# Altium schematic sheet Wifi.SchDoc
size A; DrawnBy: TIMKEN; SheetNumber: 7; SheetTotal: 7
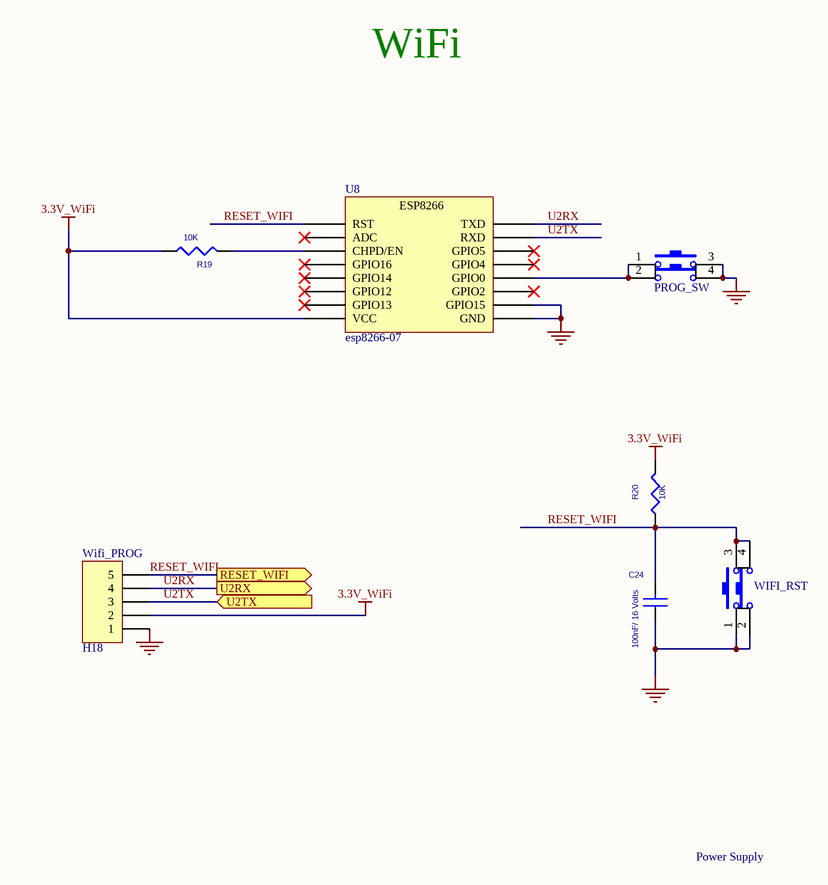
[diagram p0: Wifi.SchDoc]

## Parts
C24  100nF/ 16 Volts  [CAP_CERAMIC]
PROG_SW  SW-SMD  [SWITCH_SMD]  (value not drawn)
R19  10K  [RES_SMD]
R20  10K  [RES_SMD]
U8  esp8266-07  [esp8266-07]
Wifi_PROG  H18  [1x5_single]
WIFI_RST  SW-SMD  [SWITCH_SMD]  (value not drawn)

## Ports
RESET_WIFI (out), U2RX (out), U2TX (in)

## Nets
3.3V_WiFi: R19.1 R20.2 U8.7(VCC) Wifi_PROG.2
GND_POWER: C24.1 PROG_SW.3 PROG_SW.4 U8.8(GND) U8.9(GPIO15) Wifi_PROG.1 WIFI_RST.1 WIFI_RST.2
RESET_WIFI: C24.2 R20.1 U8.0(RST) Wifi_PROG.5 WIFI_RST.3 WIFI_RST.4 ; port RESET_WIFI
U2RX: U8.15(TXD) Wifi_PROG.4 ; port U2RX
U2TX: U8.14(RXD) Wifi_PROG.3 ; port U2TX
NetPROG_SW_1: PROG_SW.1 PROG_SW.2 U8.11(GPIO0)
NetR19_2: R19.2 U8.2(CHPD/EN)

Not connected (* = marked no-connect by the designer): U8 1(ADC)* 3(GPIO16)* 4(GPIO14)* 5(GPIO12)* 6(GPIO13)* 10(GPIO2)* 12(GPIO4)* 13(GPIO5)*

## Notes on the sheet
- WiFi
- Power Supply
- (in symbol esp8266-07) ESP8266 /

## Library data of the parts
C24 = CAP NP: V P No: 644160RL; Vendor: Farnell; M P No: CC0805KRX7R7BB104; Descr: CAPACITOR, 0805, 100NF, 16V, X7R; FootPrint: C0805
PROG_SW WIFI_RST = SW-SMD: Switch; V P No: SW836CT-ND; M P No: B3S-1000P; Vendor: Digikey; Descr: SWITCH TACTILE SPST-NO 0.05A 24V; Published: 24-Mar-1999; LatestRevisionDate: 17-Jul-2002; LatestRevisionNote: Re-released for DXP Platform.; PackageReference: SPST-2; Publisher: Altium Limited; PackageDescription: Switch; 2 Leads; FootPrint: 6.60mm x 6.00mm  Outlile(Refer Datasheet)
R19 R20 = RESISTOR: Vendor: Digikey; Descr: RES 10K OHM 1/2W 5% 0805 SMD; V P No: P10KADTR-ND; M P No: ERJ-P06J103V; FootPrint: 0.079" L x 0.049" W (2.00mm x 1.25mm)  (0805 (2012 Metric)  )
U8 = esp8266-07: 4-Bit Loadable Cascadable Binary Counter with Clock Enable and Asynchronous Clear, Single Pin Version; XilinxEquivalent: CB4CLE; ClockTrigger: Rising; Enable: High; Loadable: True; PortSize: 4; ArchiveName: GENERIC; VHDLIB_SIM: GENERIC_LIB; Published: 29-Jan-2004; Publisher: Altium Limited; LastRevisionNo: 1.00.00; HelpURL: CR0118 FPGA Generic Library Guide.pdf#page=130; ComponentLink1URL: CR0130 FPGA Counter Resource Usage.pdf#page=18; ComponentLink1Description: Core &Resource Usage; FunctionalClass: Counter; SubClass: Binary; Reset: Asynchronous; PortType: Single Pin Version
Wifi_PROG = Header 5: Header, 5-Pin; LatestRevisionDate: 17-Jul-2002; LatestRevisionNote: Re-released for DXP Platform.; Publisher: Altium Limited